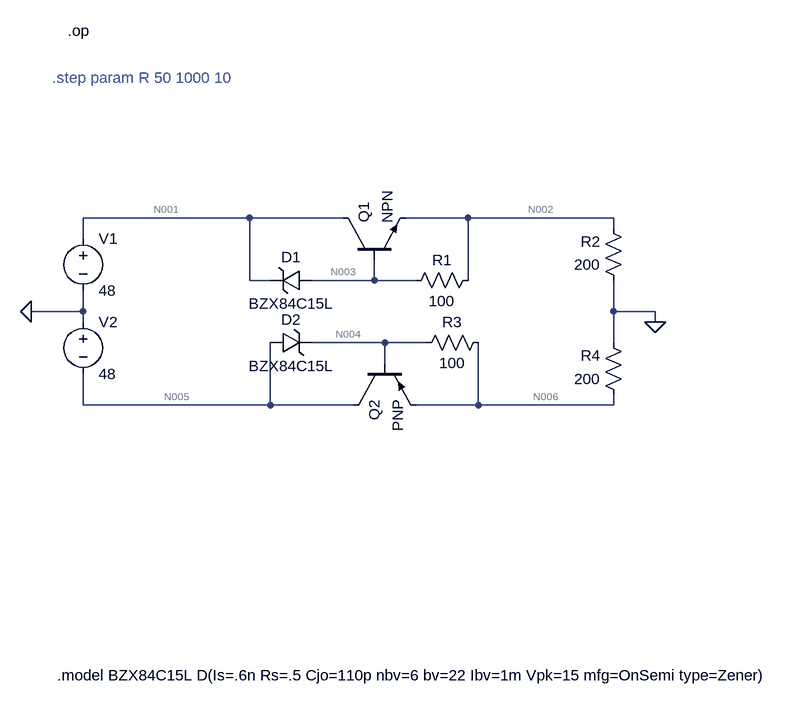
[diagram p0: schematic Positive and Negative Step Down.asc]
Positive and Negative Step Down.asc, the LTspice schematic file:
Version 4
SHEET 1 1032 848
WIRE 192 -64 -64 -64
WIRE 336 -64 192 -64
WIRE 528 -64 432 -64
WIRE 752 -64 528 -64
WIRE 752 -48 752 -64
WIRE -64 -32 -64 -64
WIRE 192 32 192 -64
WIRE 224 32 192 32
WIRE 384 32 384 0
WIRE 384 32 288 32
WIRE 448 32 384 32
WIRE 528 32 528 -64
WIRE -64 80 -64 48
WIRE -64 80 -144 80
WIRE 752 80 752 32
WIRE 816 80 752 80
WIRE -64 96 -64 80
WIRE 816 96 816 80
WIRE 400 128 288 128
WIRE 464 128 400 128
WIRE 752 128 752 80
WIRE 400 160 400 128
WIRE -64 224 -64 176
WIRE 224 224 224 128
WIRE 224 224 -64 224
WIRE 352 224 224 224
WIRE 544 224 544 128
WIRE 544 224 448 224
WIRE 752 224 752 208
WIRE 752 224 544 224
FLAG -144 80 0
FLAG 816 96 0
SYMBOL voltage -64 -48 R0
SYMATTR InstName V1
SYMATTR Value 48
SYMBOL voltage -64 80 R0
SYMATTR InstName V2
SYMATTR Value 48
SYMBOL npn 336 0 R270
SYMATTR InstName Q1
SYMBOL res 544 16 R90
WINDOW 0 0 56 VBottom 2
WINDOW 3 32 56 VTop 2
SYMATTR InstName R1
SYMATTR Value 100
SYMBOL res 768 48 R180
WINDOW 0 36 76 Left 2
WINDOW 3 36 40 Left 2
SYMATTR InstName R2
SYMATTR Value 200
SYMBOL zener 288 16 R90
WINDOW 0 -4 32 VBottom 2
WINDOW 3 36 32 VTop 2
SYMATTR InstName D1
SYMATTR Value BZX84C15L
SYMBOL pnp 352 160 M90
SYMATTR InstName Q2
SYMBOL zener 224 144 R270
WINDOW 0 36 32 VTop 2
WINDOW 3 -4 32 VBottom 2
SYMATTR InstName D2
SYMATTR Value BZX84C15L
SYMBOL res 560 112 R90
WINDOW 0 0 56 VBottom 2
WINDOW 3 32 56 VTop 2
SYMATTR InstName R3
SYMATTR Value 100
SYMBOL res 768 224 R180
WINDOW 0 36 76 Left 2
WINDOW 3 36 40 Left 2
SYMATTR InstName R4
SYMATTR Value 200
TEXT -104 640 Left 2 !.model BZX84C15L D(Is=.6n Rs=.5 Cjo=110p nbv=6 bv=22 Ibv=1m Vpk=15 mfg=OnSemi type=Zener)
TEXT -88 -352 Left 2 !.op
TEXT -112 -280 Left 2 ;.step param R 50 1000 10

The netlist it stands for:
* Positive and Negative Step Down.asc
V1 N001 0 48
V2 0 N005 48
Q1 N001 N003 N002 0 NPN
R1 N002 N003 100
R2 0 N002 200
D1 N003 N001 BZX84C15L
Q2 N005 N004 N006 0 PNP
D2 N005 N004 BZX84C15L
R3 N006 N004 100
R4 N006 0 200
.model D D
.lib standard.dio
.model NPN NPN
.model PNP PNP
.lib standard.bjt
.model BZX84C15L D(Is=.6n Rs=.5 Cjo=110p nbv=6 bv=22 Ibv=1m Vpk=15 mfg=OnSemi type=Zener)
.op
* .step param R 50 1000 10
.backanno
.end

* Results of the author's LTspice run, read from the files saved beside the schematic
* Operating Point:
*   V(n001) = 48 V
*   V(n005) = -48 V
*   V(n003) = 25.64 V
*   V(n002) = 24.74 V
*   V(n004) = -25.64 V
*   V(n006) = -24.74 V
*   Ic(Q2) = -113.6 mA
*   Ib(Q2) = -1.136 mA
*   Ie(Q2) = 114.7 mA
*   Ic(Q1) = 113.6 mA
*   Ib(Q1) = 1.136 mA
*   Ie(Q1) = -114.7 mA
*   I(D2) = -10.1 mA
*   I(D1) = -10.1 mA
*   I(R4) = -123.7 mA
*   I(R3) = 8.966 mA
*   I(R2) = -123.7 mA
*   I(R1) = -8.966 mA
*   I(V2) = -123.7 mA
*   I(V1) = -123.7 mA
* From the log:
*   Semiconductor Device Operating Points:
*                           --- Diodes ---
*   Name:      d2          d1
*   Model:  bzx84c15l   bzx84c15l
*   Id:     -1.01e-02   -1.01e-02
*   Vd:     -2.24e+01   -2.24e+01
*   Req:     1.54e+01    1.54e+01
*   CAP:     2.28e-11    2.28e-11
*                           --- Bipolar Transistors ---
*   Name:       q2          q1
*   Model:      pnp         npn
*   Ib:      -1.14e-03    1.14e-03
*   Ic:      -1.14e-01    1.14e-01
*   Vbe:     -8.97e-01    8.97e-01
*   Vbc:      2.24e+01   -2.24e+01
*   Vce:     -2.33e+01    2.33e+01
*   BetaDC:   1.00e+02    1.00e+02
*   Gm:       4.39e+00    4.39e+00
*   Rpi:      2.28e+01    2.28e+01
*   Rx:       0.00e+00    0.00e+00
*   Ro:       0.00e+00    0.00e+00
*   Cbe:      0.00e+00    0.00e+00
*   Cbc:      0.00e+00    0.00e+00
*   Cjs:      0.00e+00    0.00e+00
*   BetaAC:   1.00e+02    1.00e+02
*   Cbx:      0.00e+00    0.00e+00
*   Ft:       0.00e+00    0.00e+00
*   Operating Bias Point Solution:
*           V(n001)                 48   voltage
*           V(n005)                -48   voltage
*           V(n003)             25.636   voltage
*           V(n002)            24.7394   voltage
*           V(n004)            -25.636   voltage
*           V(n006)           -24.7394   voltage
*            Ic(Q2)          -0.113594   device_current
*            Ib(Q2)        -0.00113594   device_current
*            Ie(Q2)            0.11473   device_current
*            Ic(Q1)           0.113594   device_current
*            Ib(Q1)         0.00113594   device_current
*            Ie(Q1)           -0.11473   device_current
*             I(D2)         -0.0101024   device_current
*             I(D1)         -0.0101024   device_current
*             I(R4)          -0.123697   device_current
*             I(R3)         0.00896641   device_current
*             I(R2)          -0.123697   device_current
*             I(R1)        -0.00896641   device_current
*             I(V2)          -0.123697   device_current
*             I(V1)          -0.123697   device_current